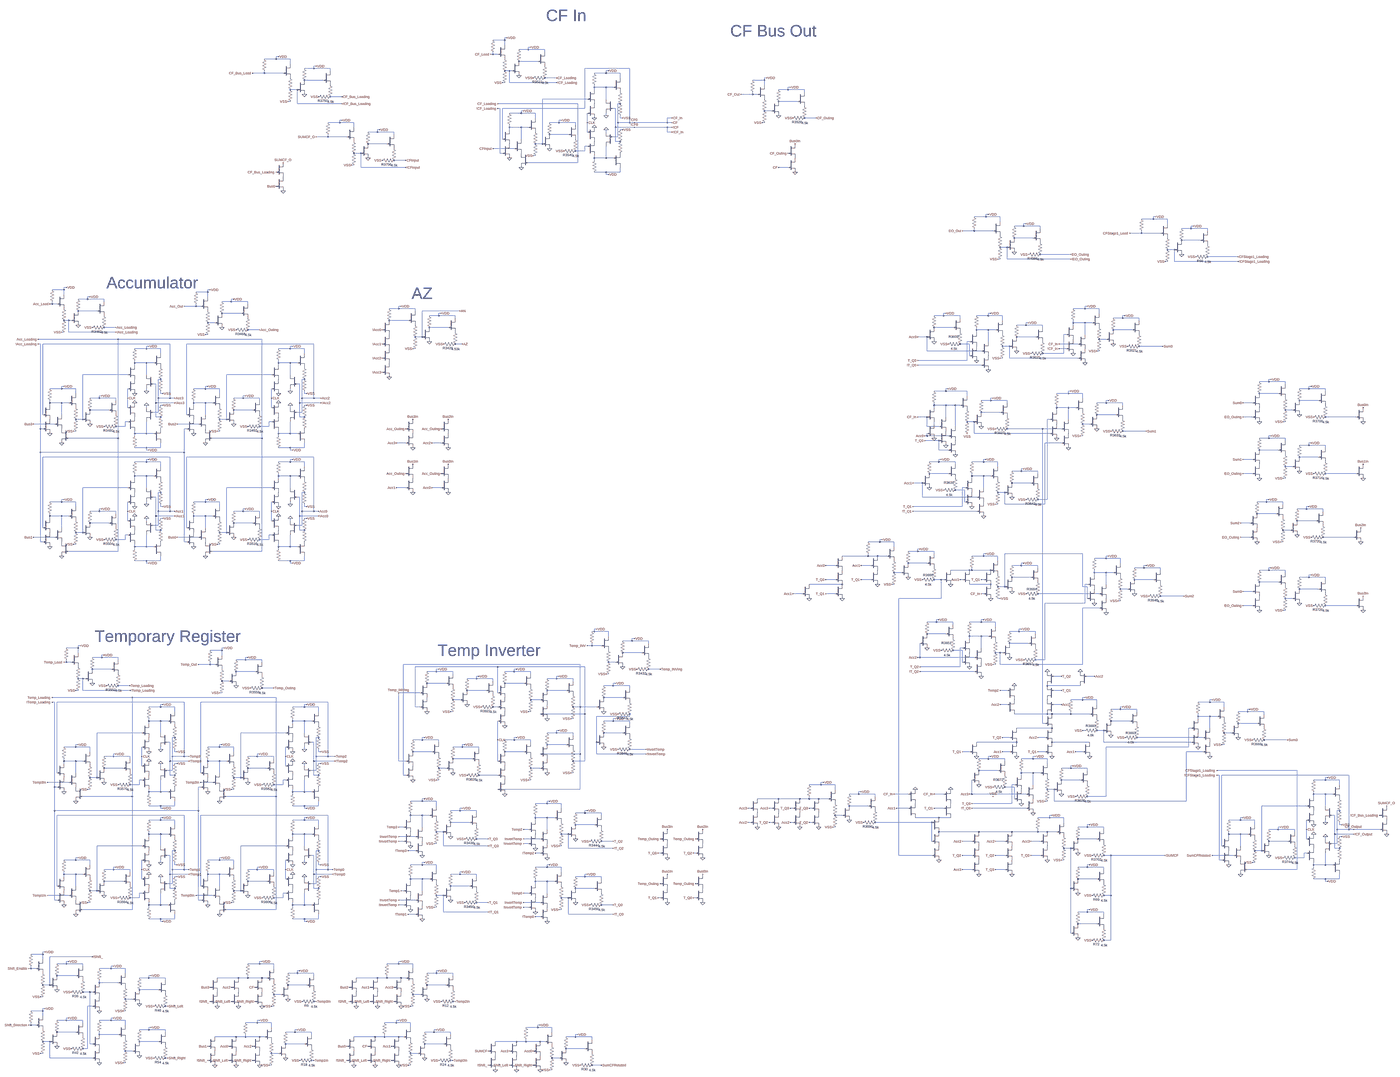
[diagram p0: schematic alu.asc, whole sheet]
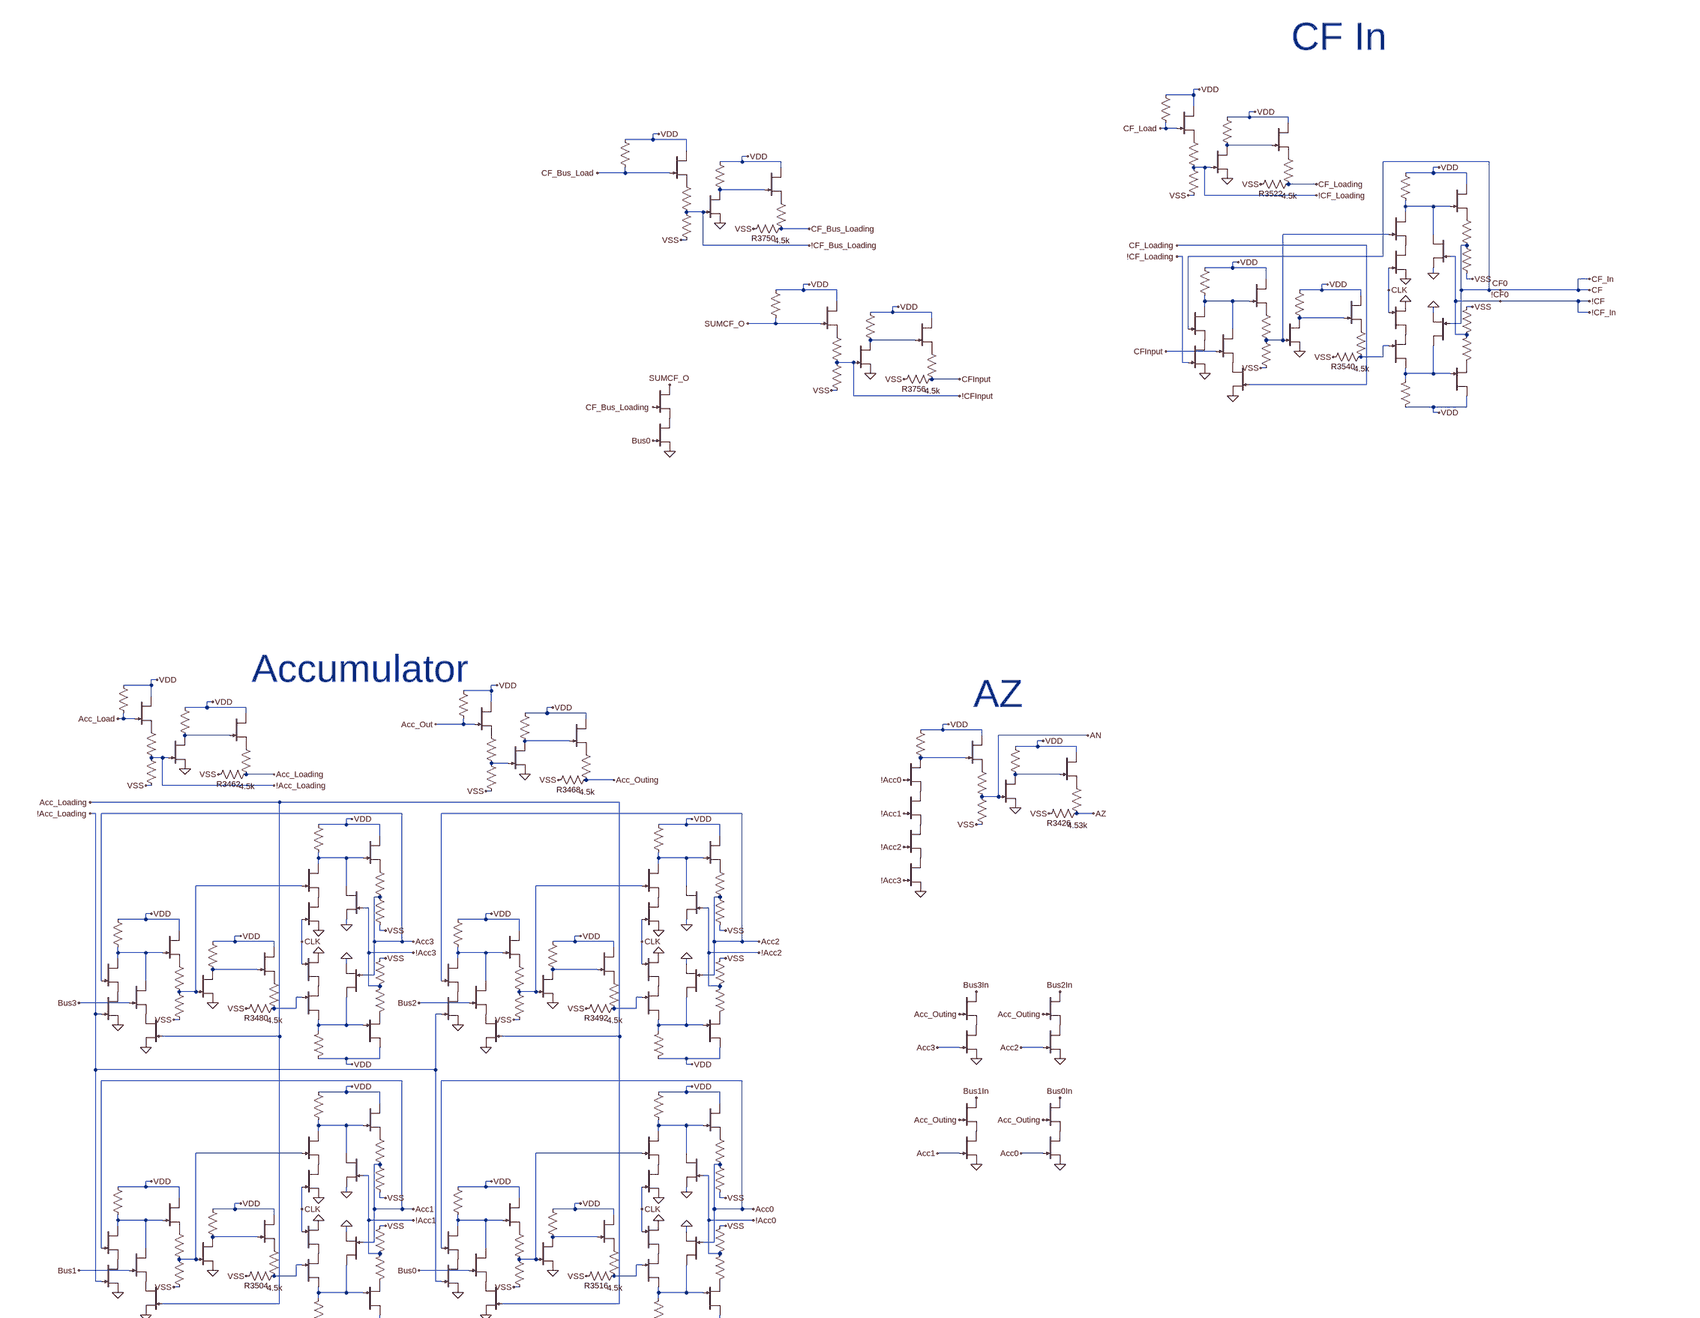
[diagram p1: schematic alu.asc, part, row 1 of 2, column 1 of 2]
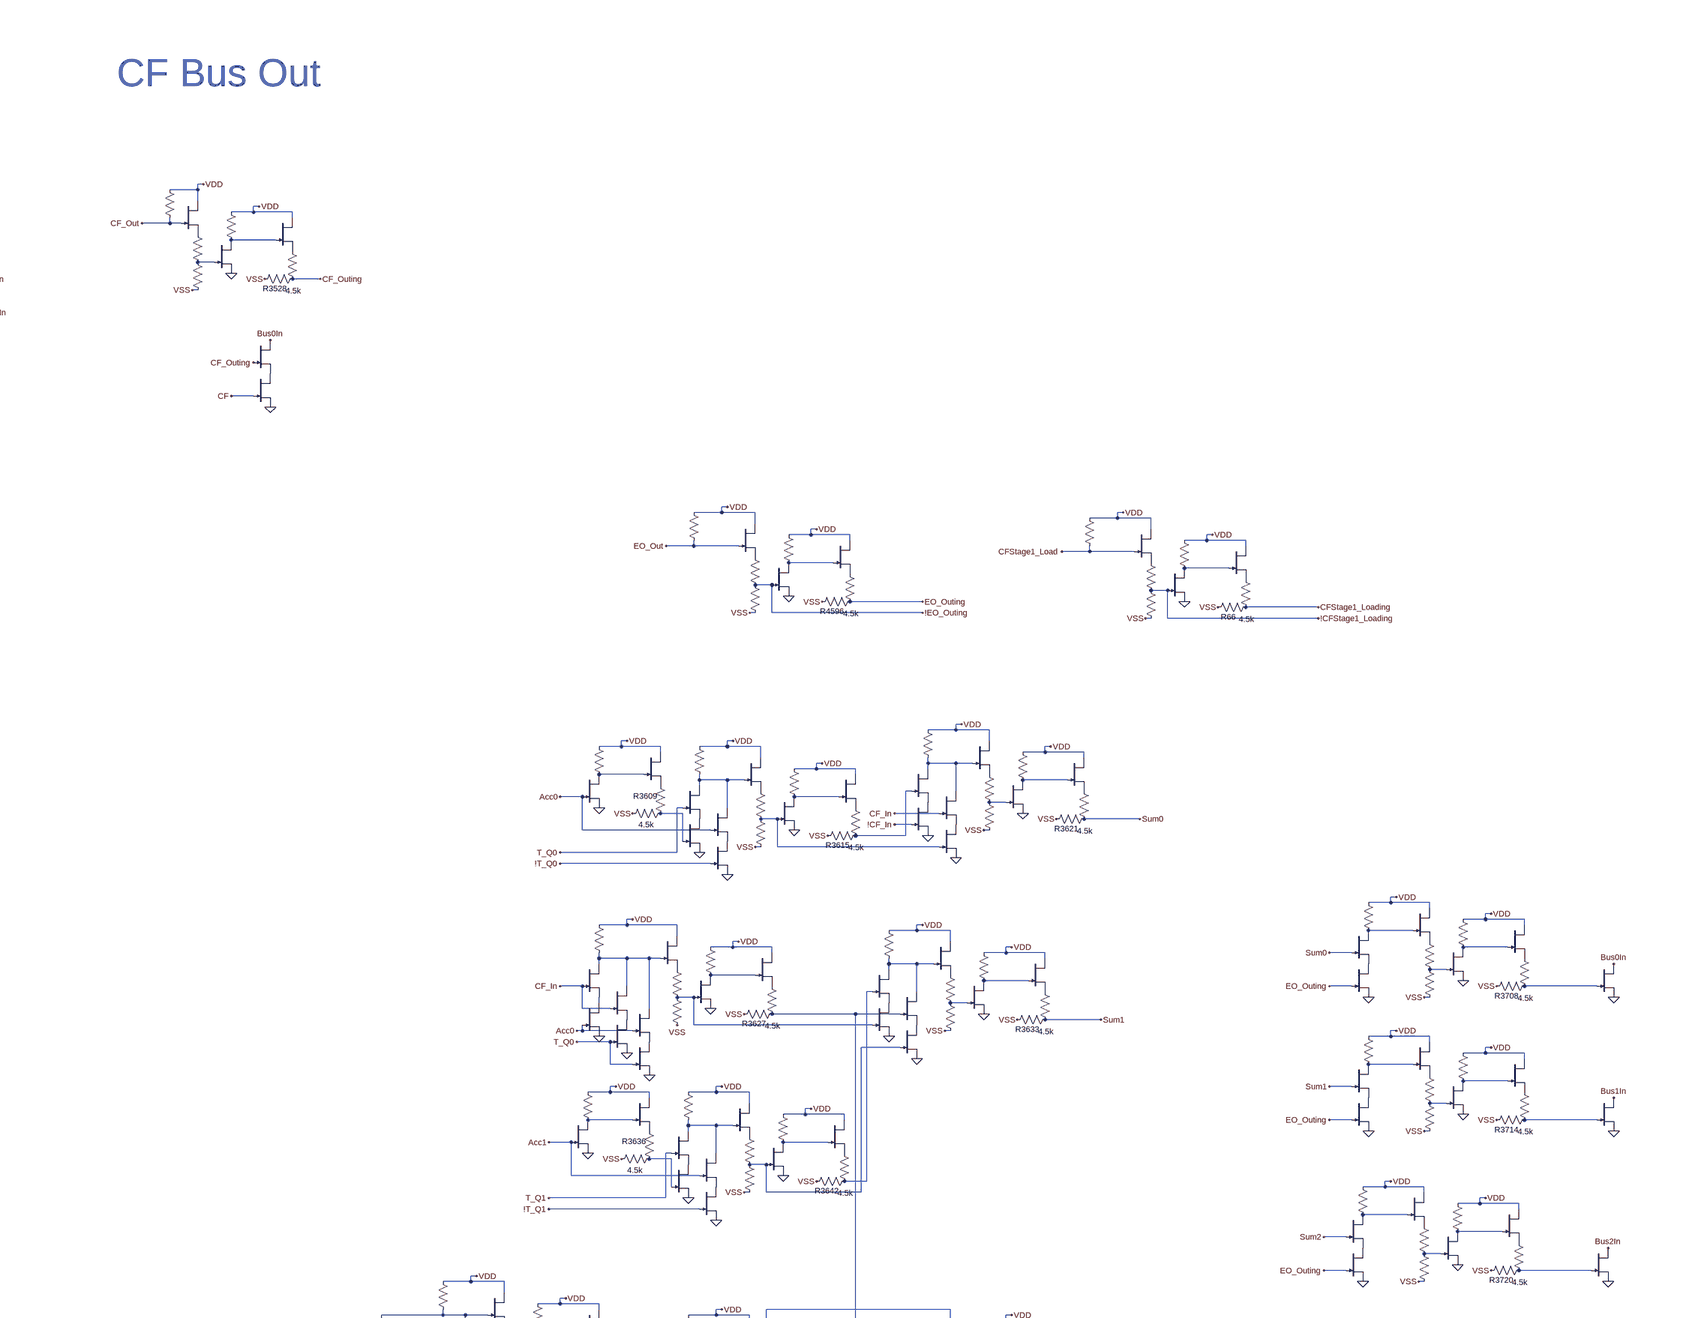
[diagram p2: schematic alu.asc, part, row 1 of 2, column 2 of 2]
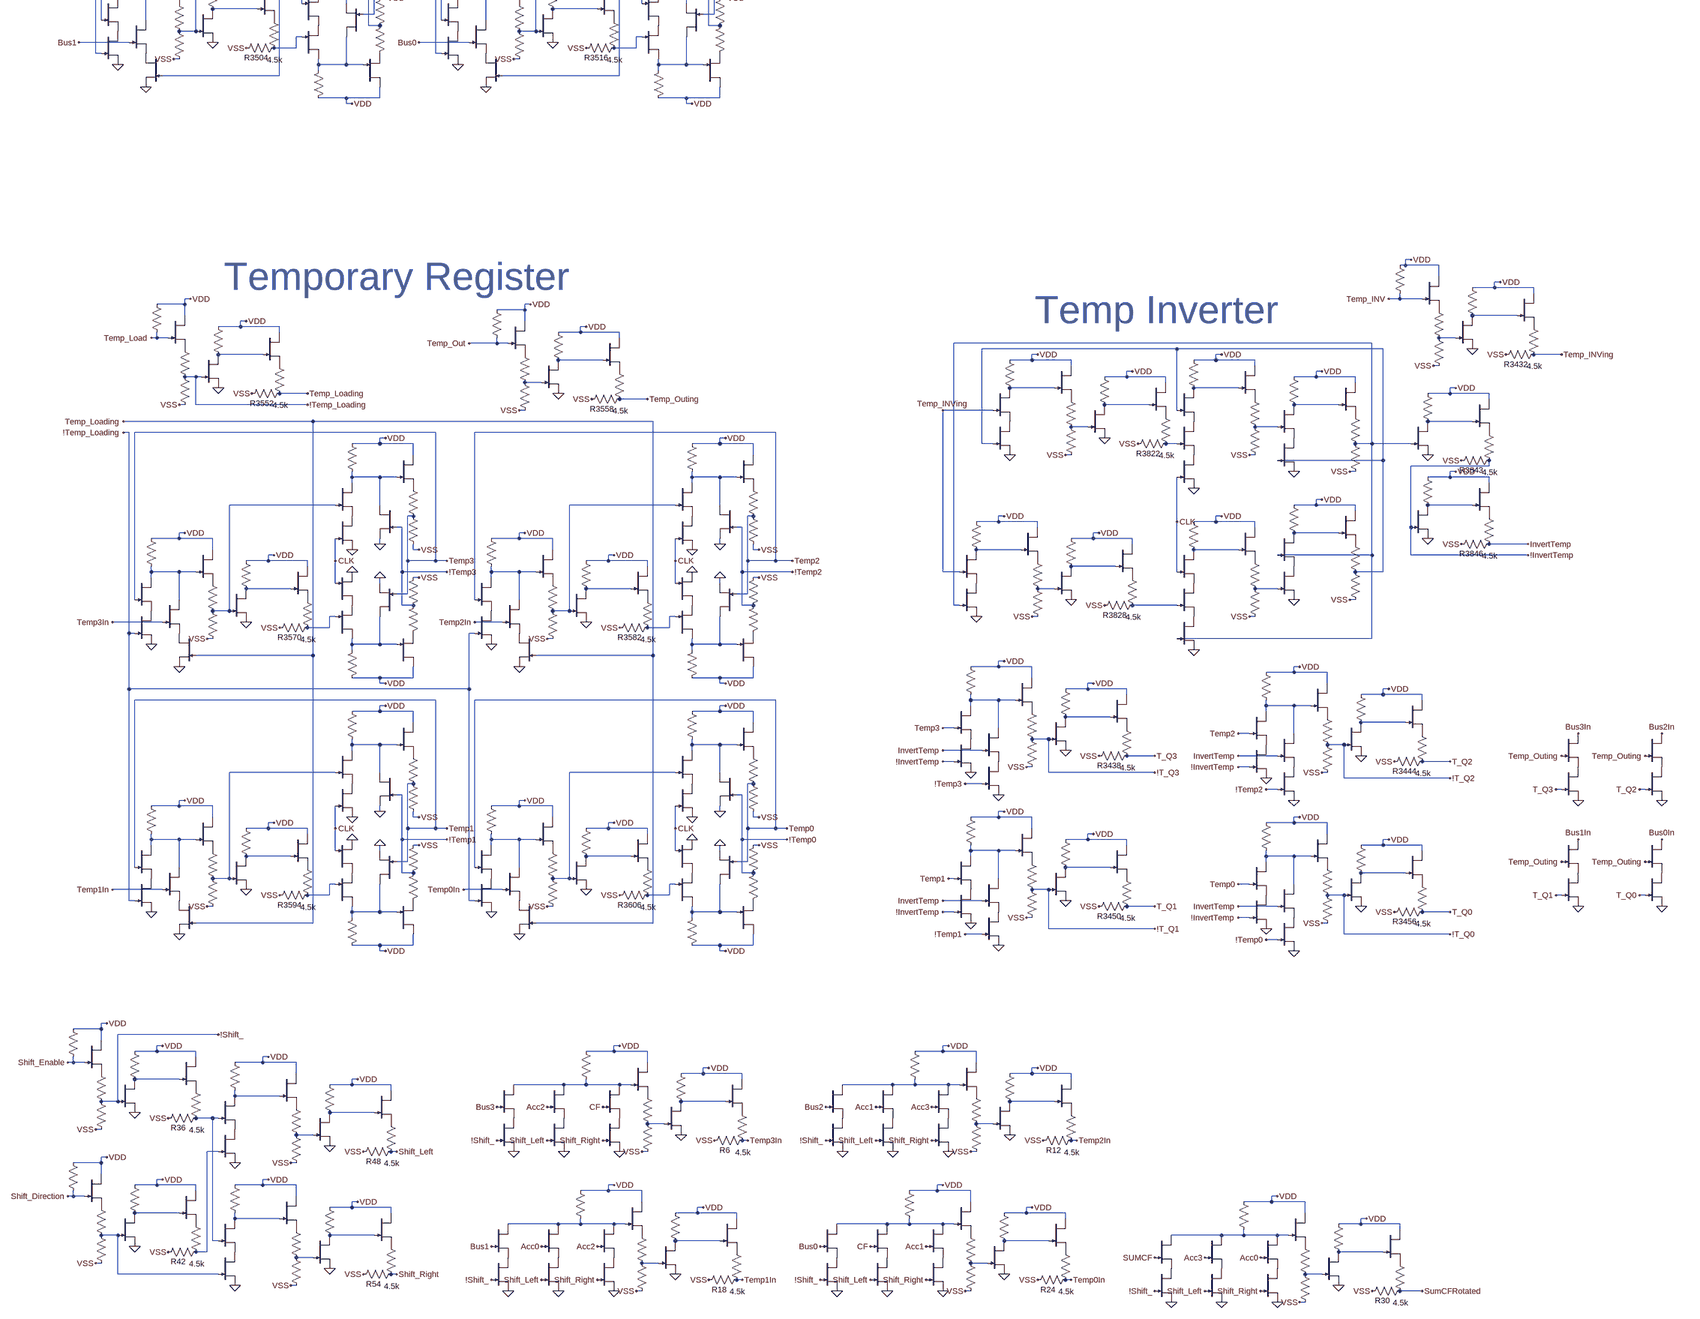
[diagram p3: schematic alu.asc, part, row 2 of 2, column 1 of 2]
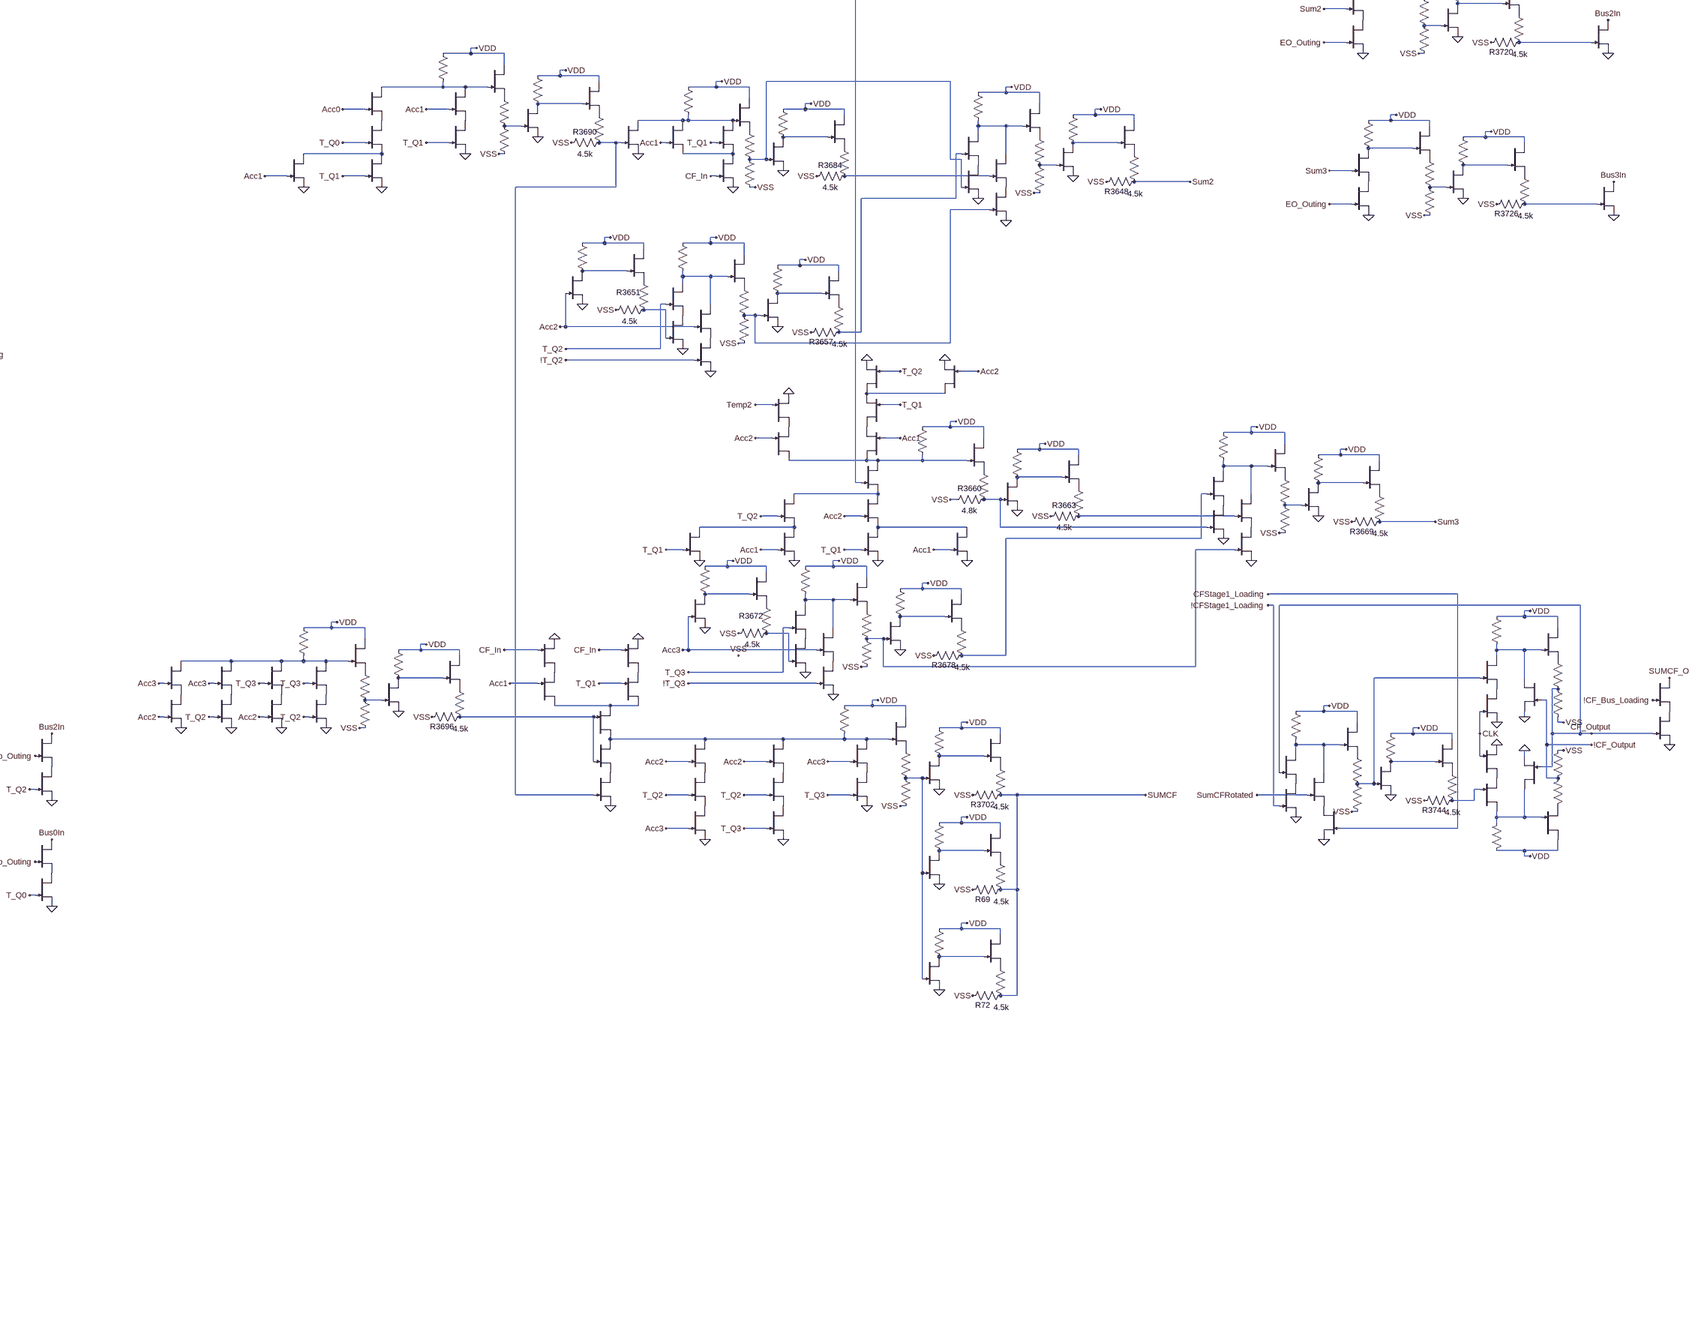
[diagram p4: schematic alu.asc, part, row 2 of 2, column 2 of 2]
* alu.asc
J_A2103 N016 !Acc0 P001 DR
R3421 VDD N016 100k
J_F874 VDD N016 P002 DR
R3422 P002 AN 1k
R3423 AN VSS 4.8k
J_B993 P001 !Acc1 P003 DR
J_A2104 N019 AN 0 DR
R3424 VDD N019 50k
J_F875 VDD N019 P004 DR
R3425 P004 AZ 1k
R3426 AZ VSS 4.53k
J_C1 P003 !Acc2 P005 DR
J_D1 P005 !Acc3 0 DR
J_A2105 P006 T_Q3 0 DR
J_A2106 Bus3In Temp_Outing P006 DR
J_A2107 P007 T_Q2 0 DR
J_A2108 Bus2In Temp_Outing P007 DR
J_A2109 P008 T_Q1 0 DR
J_A2110 Bus1In Temp_Outing P008 DR
J_A2111 P009 T_Q0 0 DR
J_A2112 Bus0In Temp_Outing P009 DR
R3427 VDD Temp_INV 100k
J_F876 VDD Temp_INV P010 DR
R3428 P010 N102 1k
R3429 N102 VSS 4.8k
J_A2113 N101 N102 0 DR
R3430 VDD N101 50k
J_A2114 VDD N101 P011 DR
R3431 P011 Temp_INVing 1k
R3432 Temp_INVing VSS 4.5k
J_A2115 N157 Temp3 P012 DR
R3433 VDD N157 100k
J_F877 VDD N157 P013 DR
R3434 P013 !T_Q3 1k
R3435 !T_Q3 VSS 4.8k
J_B994 N157 InvertTemp P014 DR
J_A2116 N161 !T_Q3 0 DR
R3436 VDD N161 50k
J_A2117 VDD N161 P015 DR
R3437 P015 T_Q3 1k
R3438 T_Q3 VSS 4.5k
J_A2118 P012 !InvertTemp 0 DR
J_B995 P014 !Temp3 0 DR
J_A2119 N159 Temp2 P016 DR
R3439 VDD N159 100k
J_F878 VDD N159 P017 DR
R3440 P017 !T_Q2 1k
R3441 !T_Q2 VSS 4.8k
J_B996 N159 InvertTemp P018 DR
J_A2120 N163 !T_Q2 0 DR
R3442 VDD N163 50k
J_A2121 VDD N163 P019 DR
R3443 P019 T_Q2 1k
R3444 T_Q2 VSS 4.5k
J_A2122 P016 !InvertTemp 0 DR
J_B997 P018 !Temp2 0 DR
J_A2123 N177 Temp1 P020 DR
R3445 VDD N177 100k
J_F879 VDD N177 P021 DR
R3446 P021 !T_Q1 1k
R3447 !T_Q1 VSS 4.8k
J_B998 N177 InvertTemp P022 DR
J_A2124 N182 !T_Q1 0 DR
R3448 VDD N182 50k
J_A2125 VDD N182 P023 DR
R3449 P023 T_Q1 1k
R3450 T_Q1 VSS 4.5k
J_A2126 P020 !InvertTemp 0 DR
J_B999 P022 !Temp1 0 DR
J_A2127 N181 Temp0 P024 DR
R3451 VDD N181 100k
J_F880 VDD N181 P025 DR
R3452 P025 !T_Q0 1k
R3453 !T_Q0 VSS 4.8k
J_B1000 N181 InvertTemp P026 DR
J_A2128 N183 !T_Q0 0 DR
R3454 VDD N183 50k
J_A2129 VDD N183 P027 DR
R3455 P027 T_Q0 1k
R3456 T_Q0 VSS 4.5k
J_A2130 P024 !InvertTemp 0 DR
J_B1001 P026 !Temp0 0 DR
R3457 VDD Acc_Load 100k
J_F881 VDD Acc_Load P028 DR
R3458 P028 !Acc_Loading 1k
R3459 !Acc_Loading VSS 4.8k
J_A2131 N014 !Acc_Loading 0 DR
R3460 VDD N014 50k
J_A2132 VDD N014 P029 DR
R3461 P029 Acc_Loading 1k
R3462 Acc_Loading VSS 4.5k
R3463 VDD Acc_Out 100k
J_F882 VDD Acc_Out P030 DR
R3464 P030 N017 1k
R3465 N017 VSS 4.8k
J_A2133 N015 N017 0 DR
R3466 VDD N015 50k
J_A2134 VDD N015 P031 DR
R3467 P031 Acc_Outing 1k
R3468 Acc_Outing VSS 4.5k
J_A2135 N028 N030 P032 DR
R3469 VDD N028 100k
J_F883 VDD N028 P033 DR
R3470 P033 Acc3 1k
R3471 Acc3 VSS 4.8k
J_B1002 N028 !Acc3 0 DR
J_A2136 N051 N045 P034 DR
R3472 VDD N051 100k
J_F884 VDD N051 P035 DR
R3473 P035 !Acc3 1k
R3474 !Acc3 VSS 4.8k
J_B1003 N051 Acc3 0 DR
J_A2137 P032 CLK 0 DR
J_A2138 P034 CLK 0 DR
J_A2139 N034 Acc3 P036 DR
R3475 VDD N034 100k
J_F885 VDD N034 P037 DR
R3476 P037 N030 1k
R3477 N030 VSS 4.8k
J_B1004 N034 Bus3 P038 DR
J_A2140 N038 N030 0 DR
R3478 VDD N038 50k
J_A2141 VDD N038 P039 DR
R3479 P039 N045 1k
R3480 N045 VSS 4.5k
J_A2142 P036 !Acc_Loading 0 DR
J_B1005 P038 Acc_Loading 0 DR
J_A2143 N029 N031 P040 DR
R3481 VDD N029 100k
J_F886 VDD N029 P041 DR
R3482 P041 Acc2 1k
R3483 Acc2 VSS 4.8k
J_B1006 N029 !Acc2 0 DR
J_A2144 N052 N046 P042 DR
R3484 VDD N052 100k
J_F887 VDD N052 P043 DR
R3485 P043 !Acc2 1k
R3486 !Acc2 VSS 4.8k
J_B1007 N052 Acc2 0 DR
J_A2145 P040 CLK 0 DR
J_A2146 P042 CLK 0 DR
J_A2147 N035 Acc2 P044 DR
R3487 VDD N035 100k
J_F888 VDD N035 P045 DR
R3488 P045 N031 1k
R3489 N031 VSS 4.8k
J_B1008 N035 Bus2 P046 DR
J_A2148 N039 N031 0 DR
R3490 VDD N039 50k
J_A2149 VDD N039 P047 DR
R3491 P047 N046 1k
R3492 N046 VSS 4.5k
J_A2150 P044 !Acc_Loading 0 DR
J_B1009 P046 Acc_Loading 0 DR
J_A2151 N059 N063 P048 DR
R3493 VDD N059 100k
J_F889 VDD N059 P049 DR
R3494 P049 Acc1 1k
R3495 Acc1 VSS 4.8k
J_B1010 N059 !Acc1 0 DR
J_A2152 N076 N073 P050 DR
R3496 VDD N076 100k
J_F890 VDD N076 P051 DR
R3497 P051 !Acc1 1k
R3498 !Acc1 VSS 4.8k
J_B1011 N076 Acc1 0 DR
J_A2153 P048 CLK 0 DR
J_A2154 P050 CLK 0 DR
J_A2155 N067 Acc1 P052 DR
R3499 VDD N067 100k
J_F891 VDD N067 P053 DR
R3500 P053 N063 1k
R3501 N063 VSS 4.8k
J_B1012 N067 Bus1 P054 DR
J_A2156 N070 N063 0 DR
R3502 VDD N070 50k
J_A2157 VDD N070 P055 DR
R3503 P055 N073 1k
R3504 N073 VSS 4.5k
J_A2158 P052 !Acc_Loading 0 DR
J_B1013 P054 Acc_Loading 0 DR
J_A2159 N060 N064 P056 DR
R3505 VDD N060 100k
J_F892 VDD N060 P057 DR
R3506 P057 Acc0 1k
R3507 Acc0 VSS 4.8k
J_B1014 N060 !Acc0 0 DR
J_A2160 N077 N074 P058 DR
R3508 VDD N077 100k
J_F893 VDD N077 P059 DR
R3509 P059 !Acc0 1k
R3510 !Acc0 VSS 4.8k
J_B1015 N077 Acc0 0 DR
J_A2161 P056 CLK 0 DR
J_A2162 P058 CLK 0 DR
J_A2163 N068 Acc0 P060 DR
R3511 VDD N068 100k
J_F894 VDD N068 P061 DR
R3512 P061 N064 1k
R3513 N064 VSS 4.8k
J_B1016 N068 Bus0 P062 DR
J_A2164 N071 N064 0 DR
R3514 VDD N071 50k
J_A2165 VDD N071 P063 DR
R3515 P063 N074 1k
R3516 N074 VSS 4.5k
J_A2166 P060 !Acc_Loading 0 DR
J_B1017 P062 Acc_Loading 0 DR
R3517 VDD CF_Load 100k
J_F895 VDD CF_Load P064 DR
R3518 P064 !CF_Loading 1k
R3519 !CF_Loading VSS 4.8k
J_A2167 N001 !CF_Loading 0 DR
R3520 VDD N001 50k
J_A2168 VDD N001 P065 DR
R3521 P065 CF_Loading 1k
R3522 CF_Loading VSS 4.5k
R3523 VDD CF_Out 100k
J_F896 VDD CF_Out P066 DR
R3524 P066 N006 1k
R3525 N006 VSS 4.8k
J_A2169 N005 N006 0 DR
R3526 VDD N005 50k
J_A2170 VDD N005 P067 DR
R3527 P067 CF_Outing 1k
R3528 CF_Outing VSS 4.5k
J_A2171 N003 N004 P068 DR
R3529 VDD N003 100k
J_F897 VDD N003 P069 DR
R3530 P069 CF0 1k
R3531 CF0 VSS 4.8k
J_B1018 N003 !CF 0 DR
J_A2172 N011 N010 P070 DR
R3532 VDD N011 100k
J_F898 VDD N011 P071 DR
R3533 P071 !CF 1k
R3534 !CF VSS 4.8k
J_B1019 N011 CF0 0 DR
J_A2173 P068 CLK 0 DR
J_A2174 P070 CLK 0 DR
J_A2175 N007 CF0 P072 DR
R3535 VDD N007 100k
J_F899 VDD N007 P073 DR
R3536 P073 N004 1k
R3537 N004 VSS 4.8k
J_B1020 N007 CFInput P074 DR
J_A2176 N008 N004 0 DR
R3538 VDD N008 50k
J_A2177 VDD N008 P075 DR
R3539 P075 N010 1k
R3540 N010 VSS 4.5k
J_A2178 P072 !CF_Loading 0 DR
J_B1021 P074 CF_Loading 0 DR
J_A2181 P076 CF0 0 DR
J_A2182 Bus0In CF_Outing P076 DR
R3547 VDD Temp_Load 100k
J_F901 VDD Temp_Load P077 DR
R3548 P077 !Temp_Loading 1k
R3549 !Temp_Loading VSS 4.8k
J_A2183 N105 !Temp_Loading 0 DR
R3550 VDD N105 50k
J_A2184 VDD N105 P078 DR
R3551 P078 Temp_Loading 1k
R3552 Temp_Loading VSS 4.5k
R3553 VDD Temp_Out 100k
J_F902 VDD Temp_Out P079 DR
R3554 P079 N107 1k
R3555 N107 VSS 4.8k
J_A2185 N106 N107 0 DR
R3556 VDD N106 50k
J_A2186 VDD N106 P080 DR
R3557 P080 Temp_Outing 1k
R3558 Temp_Outing VSS 4.5k
J_A2187 N119 N126 P081 DR
R3559 VDD N119 100k
J_F903 VDD N119 P082 DR
R3560 P082 Temp3 1k
R3561 Temp3 VSS 4.8k
J_B1024 N119 !Temp3 0 DR
J_A2188 N151 N147 P083 DR
R3562 VDD N151 100k
J_F904 VDD N151 P084 DR
R3563 P084 !Temp3 1k
R3564 !Temp3 VSS 4.8k
J_B1025 N151 Temp3 0 DR
J_A2189 P081 CLK 0 DR
J_A2190 P083 CLK 0 DR
J_A2191 N138 Temp3 P085 DR
R3565 VDD N138 100k
J_F905 VDD N138 P086 DR
R3566 P086 N126 1k
R3567 N126 VSS 4.8k
J_B1026 N138 Temp3In P087 DR
J_A2192 N140 N126 0 DR
R3568 VDD N140 50k
J_A2193 VDD N140 P088 DR
R3569 P088 N147 1k
R3570 N147 VSS 4.5k
J_A2194 P085 !Temp_Loading 0 DR
J_B1027 P087 Temp_Loading 0 DR
J_A2195 N120 N127 P089 DR
R3571 VDD N120 100k
J_F906 VDD N120 P090 DR
R3572 P090 Temp2 1k
R3573 Temp2 VSS 4.8k
J_B1028 N120 !Temp2 0 DR
J_A2196 N152 N148 P091 DR
R3574 VDD N152 100k
J_F907 VDD N152 P092 DR
R3575 P092 !Temp2 1k
R3576 !Temp2 VSS 4.8k
J_B1029 N152 Temp2 0 DR
J_A2197 P089 CLK 0 DR
J_A2198 P091 CLK 0 DR
J_A2199 N139 Temp2 P093 DR
R3577 VDD N139 100k
J_F908 VDD N139 P094 DR
R3578 P094 N127 1k
R3579 N127 VSS 4.8k
J_B1030 N139 Temp2In P095 DR
J_A2200 N141 N127 0 DR
R3580 VDD N141 50k
J_A2201 VDD N141 P096 DR
R3581 P096 N148 1k
R3582 N148 VSS 4.5k
J_A2202 P093 !Temp_Loading 0 DR
J_B1031 P095 Temp_Loading 0 DR
J_A2203 N165 N170 P097 DR
R3583 VDD N165 100k
J_F909 VDD N165 P098 DR
R3584 P098 Temp1 1k
R3585 Temp1 VSS 4.8k
J_B1032 N165 !Temp1 0 DR
J_A2204 N186 N184 P099 DR
R3586 VDD N186 100k
J_F910 VDD N186 P100 DR
R3587 P100 !Temp1 1k
R3588 !Temp1 VSS 4.8k
J_B1033 N186 Temp1 0 DR
J_A2205 P097 CLK 0 DR
J_A2206 P099 CLK 0 DR
J_A2207 N175 Temp1 P101 DR
R3589 VDD N175 100k
J_F911 VDD N175 P102 DR
R3590 P102 N170 1k
R3591 N170 VSS 4.8k
J_B1034 N175 Temp1In P103 DR
J_A2208 N179 N170 0 DR
R3592 VDD N179 50k
J_A2209 VDD N179 P104 DR
R3593 P104 N184 1k
R3594 N184 VSS 4.5k
J_A2210 P101 !Temp_Loading 0 DR
J_B1035 P103 Temp_Loading 0 DR
J_A2211 N166 N171 P105 DR
R3595 VDD N166 100k
J_F912 VDD N166 P106 DR
R3596 P106 Temp0 1k
R3597 Temp0 VSS 4.8k
J_B1036 N166 !Temp0 0 DR
J_A2212 N187 N185 P107 DR
R3598 VDD N187 100k
J_F913 VDD N187 P108 DR
R3599 P108 !Temp0 1k
R3600 !Temp0 VSS 4.8k
J_B1037 N187 Temp0 0 DR
J_A2213 P105 CLK 0 DR
J_A2214 P107 CLK 0 DR
J_A2215 N176 Temp0 P109 DR
R3601 VDD N176 100k
J_F914 VDD N176 P110 DR
R3602 P110 N171 1k
R3603 N171 VSS 4.8k
J_B1038 N176 Temp0In P111 DR
J_A2216 N180 N171 0 DR
R3604 VDD N180 50k
J_A2217 VDD N180 P112 DR
R3605 P112 N185 1k
R3606 N185 VSS 4.5k
J_A2218 P109 !Temp_Loading 0 DR
J_B1039 P111 Temp_Loading 0 DR
J_A2219 N081 Acc1 N089 DR
J_A2220 N020 Acc0 0 DR
R3607 VDD N020 50k
J_A2221 VDD N020 P113 DR
R3608 P113 N026 1k
R3609 N026 VSS 4.5k
J_A2222 N021 T_Q0 P114 DR
R3610 VDD N021 100k
J_F915 VDD N021 P115 DR
R3611 P115 N027 1k
R3612 N027 VSS 4.8k
J_B1040 N021 Acc0 P116 DR
J_A2223 N024 N027 0 DR
R3613 VDD N024 50k
J_A2224 VDD N024 P117 DR
R3614 P117 N023 1k
R3615 N023 VSS 4.5k
J_A2225 P114 N026 0 DR
J_B1041 P116 !T_Q0 0 DR
J_A2226 N018 N023 P118 DR
R3616 VDD N018 100k
J_F916 VDD N018 P119 DR
R3617 P119 N025 1k
R3618 N025 VSS 4.8k
J_B1042 N018 CF0 P120 DR
J_A2227 N022 N025 0 DR
R3619 VDD N022 50k
J_A2228 VDD N022 P121 DR
R3620 P121 Sum0 1k
R3621 Sum0 VSS 4.5k
J_A2229 P118 !CF 0 DR
J_B1043 P120 N027 0 DR
J_A2230 N036 CF0 N048 DR
R3622 VDD N036 100k
J_F917 VDD N036 P122 DR
R3623 P122 N047 1k
R3624 N047 VSS 4.8k
J_B1044 N036 CF0 P123 DR
J_A2231 N041 N047 0 DR
R3625 VDD N041 50k
J_A2232 VDD N041 P124 DR
R3626 P124 N050 1k
R3627 N050 VSS 4.5k
J_A2233 N048 Acc0 0 DR
J_B1045 P123 T_Q0 0 DR
J_B1046 N036 Acc0 P125 DR
J_B1047 P125 T_Q0 0 DR
J_A2234 N037 N044 P126 DR
R3628 VDD N037 100k
J_F918 VDD N037 P127 DR
R3629 P127 N049 1k
R3630 N049 VSS 4.8k
J_B1048 N037 N050 P128 DR
J_A2235 N042 N049 0 DR
R3631 VDD N042 50k
J_A2236 VDD N042 P129 DR
R3632 P129 Sum1 1k
R3633 Sum1 VSS 4.5k
J_A2237 P126 N047 0 DR
J_B1049 P128 N053 0 DR
J_A2238 N057 Acc1 0 DR
R3634 VDD N057 50k
J_A2239 VDD N057 P130 DR
R3635 P130 N065 1k
R3636 N065 VSS 4.5k
J_A2240 N061 T_Q1 P131 DR
R3637 VDD N061 100k
J_F919 VDD N061 P132 DR
R3638 P132 N053 1k
R3639 N053 VSS 4.8k
J_B1050 N061 Acc1 P133 DR
J_A2241 N062 N053 0 DR
R3640 VDD N062 50k
J_A2242 VDD N062 P134 DR
R3641 P134 N044 1k
R3642 N044 VSS 4.5k
J_A2243 P131 N065 0 DR
J_B1051 P133 !T_Q1 0 DR
J_A2244 N081 T_Q1 N089 DR
J_A2245 N083 N090 P135 DR
R3643 VDD N083 100k
J_F920 VDD N083 P136 DR
R3644 P136 N091 1k
R3645 N091 VSS 4.8k
J_B1052 N083 N093 P137 DR
J_A2246 N086 N091 0 DR
R3646 VDD N086 50k
J_A2247 VDD N086 P138 DR
R3647 P138 Sum2 1k
R3648 Sum2 VSS 4.5k
J_A2248 P135 N078 0 DR
J_B1053 P137 N096 0 DR
J_A2249 N097 Acc2 0 DR
R3649 VDD N097 50k
J_A2250 VDD N097 P139 DR
R3650 P139 N100 1k
R3651 N100 VSS 4.5k
J_A2251 N098 T_Q2 P140 DR
R3652 VDD N098 100k
J_F921 VDD N098 P141 DR
R3653 P141 N096 1k
R3654 N096 VSS 4.8k
J_B1054 N098 Acc2 P142 DR
J_A2252 N099 N096 0 DR
R3655 VDD N099 50k
J_A2253 VDD N099 P143 DR
R3656 P143 N090 1k
R3657 N090 VSS 4.5k
J_A2254 P140 N100 0 DR
J_B1055 P142 !T_Q2 0 DR
R3658 VDD N117 100k
J_F922 VDD N117 P144 DR
R3659 P144 N125 1k
R3660 N125 VSS 4.8k
J_A2255 N121 N125 0 DR
R3661 VDD N121 50k
J_A2256 VDD N121 P145 DR
R3662 P145 N130 1k
R3663 N130 VSS 4.5k
J_A2257 N117 Acc2 P146 DR
J_B1056 P146 Temp2 0 DR
J_A2258 N117 Acc1 P147 DR
J_B1057 P147 T_Q1 N110 DR
J_B1058 N110 T_Q2 0 DR
J_B1059 N110 Acc2 0 DR
J_A2259 N132 Acc1 0 DR
J_A2260 N123 T_Q2 N131 DR
J_B1060 N131 Acc1 0 DR
J_A2261 N132 T_Q1 0 DR
J_B1061 N123 Acc2 N132 DR
J_B1062 N131 T_Q1 0 DR
J_B1063 N117 N050 N123 DR
J_A2262 N118 N124 P148 DR
R3664 VDD N118 100k
J_F923 VDD N118 P149 DR
R3665 P149 N129 1k
R3666 N129 VSS 4.8k
J_B1064 N118 N130 P150 DR
J_A2263 N122 N129 0 DR
R3667 VDD N122 50k
J_A2264 VDD N122 P151 DR
R3668 P151 Sum3 1k
R3669 Sum3 VSS 4.5k
J_A2265 P148 N125 0 DR
J_B1065 P150 N136 0 DR
J_A2266 N144 Acc3 0 DR
R3670 VDD N144 50k
J_A2267 VDD N144 P152 DR
R3671 P152 N150 1k
R3672 N150 VSS 4.5k
J_A2268 N145 T_Q3 P153 DR
R3673 VDD N145 100k
J_F924 VDD N145 P154 DR
R3674 P154 N136 1k
R3675 N136 VSS 4.8k
J_B1066 N145 Acc3 P155 DR
J_A2269 N149 N136 0 DR
R3676 VDD N149 50k
J_A2270 VDD N149 P156 DR
R3677 P156 N124 1k
R3678 N124 VSS 4.5k
J_A2271 P153 N150 0 DR
J_B1067 P155 !T_Q3 0 DR
R3679 VDD N081 100k
J_F925 VDD N081 P157 DR
R3680 P157 N078 1k
R3681 N078 VSS 4.8k
J_A2272 N084 N078 0 DR
R3682 VDD N084 50k
J_A2273 VDD N084 P158 DR
R3683 P158 N093 1k
R3684 N093 VSS 4.5k
J_A2274 N079 Acc1 P159 DR
J_B1068 P159 T_Q1 0 DR
J_A2275 N079 Acc0 P160 DR
J_B1069 P160 T_Q0 N088 DR
R3685 VDD N079 100k
J_F926 VDD N079 P161 DR
R3686 P161 N082 1k
R3687 N082 VSS 4.8k
J_A2276 N080 N082 0 DR
R3688 VDD N080 50k
J_A2277 VDD N080 P162 DR
R3689 P162 N085 1k
R3690 N085 VSS 4.5k
J_B1070 N088 Acc1 0 DR
J_B1071 N088 T_Q1 0 DR
J_B1072 N089 CF0 0 DR
J_A2278 N081 N085 0 DR
J_A2279 N164 N162 P163 DR
J_B1073 P163 N085 0 DR
J_A2280 N160 T_Q1 P164 DR
J_B1074 P164 CF0 0 DR
J_A2281 N160 Acc1 P165 DR
J_B1075 P165 CF0 0 DR
R3691 VDD N154 100k
J_F927 VDD N154 P166 DR
R3692 P166 N158 1k
R3693 N158 VSS 4.8k
J_A2282 N155 N158 0 DR
R3694 VDD N155 50k
J_A2283 VDD N155 P167 DR
R3695 P167 N162 1k
R3696 N162 VSS 4.5k
J_A2284 N154 Acc3 P168 DR
J_A2285 N154 T_Q3 P169 DR
J_B1076 P168 T_Q2 0 DR
J_B1077 P169 T_Q2 0 DR
J_A2286 N164 Acc3 P170 DR
J_B1078 P170 T_Q3 0 DR
J_A2287 N164 Acc2 P171 DR
J_B1079 P171 T_Q2 P172 DR
J_B1080 P172 T_Q3 0 DR
J_A2288 N164 Acc2 P173 DR
J_B1081 P173 T_Q2 P174 DR
J_B1082 P174 Acc3 0 DR
J_A2289 N164 N162 N160 DR
R3697 VDD N164 100k
J_F928 VDD N164 P175 DR
R3698 P175 N172 1k
R3699 N172 VSS 4.8k
J_A2290 N168 N172 0 DR
R3700 VDD N168 50k
J_A2291 VDD N168 P176 DR
R3701 P176 SUMCF 1k
R3702 SUMCF VSS 4.5k
J_A2292 N032 Sum0 P177 DR
R3703 VDD N032 100k
J_F929 VDD N032 P178 DR
R3704 P178 N040 1k
R3705 N040 VSS 4.8k
J_B1083 P177 EO_Outing 0 DR
J_A2293 N033 N040 0 DR
R3706 VDD N033 50k
J_F930 VDD N033 P179 DR
R3707 P179 N043 1k
R3708 N043 VSS 4.5k
J_A2294 Bus0In N043 0 DR
J_A2295 N054 Sum1 P180 DR
R3709 VDD N054 100k
J_F931 VDD N054 P181 DR
R3710 P181 N056 1k
R3711 N056 VSS 4.8k
J_B1084 P180 EO_Outing 0 DR
J_A2296 N055 N056 0 DR
R3712 VDD N055 50k
J_F932 VDD N055 P182 DR
R3713 P182 N058 1k
R3714 N058 VSS 4.5k
J_A2297 Bus1In N058 0 DR
J_A2298 N066 Sum2 P183 DR
R3715 VDD N066 100k
J_F933 VDD N066 P184 DR
R3716 P184 N072 1k
R3717 N072 VSS 4.8k
J_B1085 P183 EO_Outing 0 DR
J_A2299 N069 N072 0 DR
R3718 VDD N069 50k
J_F934 VDD N069 P185 DR
R3719 P185 N075 1k
R3720 N075 VSS 4.5k
J_A2300 Bus2In N075 0 DR
J_A2301 N087 Sum3 P186 DR
R3721 VDD N087 100k
J_F935 VDD N087 P187 DR
R3722 P187 N094 1k
R3723 N094 VSS 4.8k
J_B1086 P186 EO_Outing 0 DR
J_A2302 N092 N094 0 DR
R3724 VDD N092 50k
J_F936 VDD N092 P188 DR
R3725 P188 N095 1k
R3726 N095 VSS 4.5k
J_A2303 Bus3In N095 0 DR
J_A2307 N153 N156 P189 DR
R3733 VDD N153 100k
J_F939 VDD N153 P190 DR
R3734 P190 CF_Output 1k
R3735 CF_Output VSS 4.8k
J_B1089 N153 !CF_Output 0 DR
J_A2308 N174 N173 P191 DR
R3736 VDD N174 100k
J_F940 VDD N174 P192 DR
R3737 P192 !CF_Output 1k
R3738 !CF_Output VSS 4.8k
J_B1090 N174 CF_Output 0 DR
J_A2309 P189 CLK 0 DR
J_A2310 P191 CLK 0 DR
J_A2311 N167 CF_Output P193 DR
R3739 VDD N167 100k
J_F941 VDD N167 P194 DR
R3740 P194 N156 1k
R3741 N156 VSS 4.8k
J_B1091 N167 SumCFRotated P195 DR
J_A2312 N169 N156 0 DR
R3742 VDD N169 50k
J_A2313 VDD N169 P196 DR
R3743 P196 N173 1k
R3744 N173 VSS 4.5k
J_A2314 P193 !CFStage1_Loading 0 DR
J_B1092 P195 CFStage1_Loading 0 DR
R3745 VDD CF_Bus_Load 100k
J_F942 VDD CF_Bus_Load P197 DR
R3746 P197 !CF_Bus_Loading 1k
R3747 !CF_Bus_Loading VSS 4.8k
J_A2315 N002 !CF_Bus_Loading 0 DR
R3748 VDD N002 50k
J_A2316 VDD N002 P198 DR
R3749 P198 CF_Bus_Loading 1k
R3750 CF_Bus_Loading VSS 4.5k
J_A2317 P199 CF_Output 0 DR
J_A2318 SUMCF_O !CF_Bus_Loading P199 DR
J_A2319 SUMCF_O CF_Bus_Loading P200 DR
J_A2320 P200 Bus0 0 DR
R3751 VDD SUMCF_O 100k
J_F943 VDD SUMCF_O P201 DR
R3752 P201 !CFInput 1k
R3753 !CFInput VSS 4.8k
J_A2321 N009 !CFInput 0 DR
R3754 VDD N009 50k
J_A2322 VDD N009 P202 DR
R3755 P202 CFInput 1k
R3756 CFInput VSS 4.5k
J_A2323 P203 Acc3 0 DR
J_A2324 Bus3In Acc_Outing P203 DR
J_A2325 P204 Acc2 0 DR
J_A2326 Bus2In Acc_Outing P204 DR
J_A2327 P205 Acc1 0 DR
J_A2328 Bus1In Acc_Outing P205 DR
J_A2329 P206 Acc0 0 DR
J_A2330 Bus0In Acc_Outing P206 DR
J_A2359 N108 Temp_INVing P207 DR
R3817 VDD N108 100k
J_F959 VDD N108 P208 DR
R3818 P208 N114 1k
R3819 N114 VSS 4.8k
J_B1109 P207 N104 0 DR
J_A2360 N111 N114 0 DR
R3820 VDD N111 50k
J_F960 VDD N111 P209 DR
R3821 P209 N116 1k
R3822 N116 VSS 4.5k
J_A2361 N134 Temp_INVing P210 DR
R3823 VDD N134 100k
J_F961 VDD N134 P211 DR
R3824 P211 N142 1k
R3825 N142 VSS 4.8k
J_B1110 P210 N103 0 DR
J_A2362 N137 N142 0 DR
R3826 VDD N137 50k
J_F962 VDD N137 P212 DR
R3827 P212 N146 1k
R3828 N146 VSS 4.5k
J_A2363 N109 N104 P213 DR
R3829 VDD N109 100k
J_F963 VDD N109 P214 DR
R3830 P214 N115 1k
R3831 N115 VSS 4.8k
J_B1111 P213 N116 P215 DR
J_A2364 N135 CLK P216 DR
R3832 VDD N135 100k
J_F964 VDD N135 P217 DR
R3833 P217 N143 1k
R3834 N143 VSS 4.8k
J_B1112 P216 N146 P218 DR
J_A2365 N112 N115 P219 DR
R3835 VDD N112 100k
J_F965 VDD N112 P220 DR
R3836 P220 N103 1k
R3837 N103 VSS 4.8k
J_B1113 P219 N104 0 DR
J_A2366 N133 N103 P221 DR
R3838 VDD N133 100k
J_F966 VDD N133 P222 DR
R3839 P222 N104 1k
R3840 N104 VSS 4.8k
J_B1114 P221 N143 0 DR
J_B1115 P215 CLK 0 DR
J_B1116 P218 N103 0 DR
J_A2367 N113 N103 0 DR
R3841 VDD N113 50k
J_F967 VDD N113 P223 DR
R3842 P223 !InvertTemp 1k
R3843 !InvertTemp VSS 4.5k
J_A2368 N128 !InvertTemp 0 DR
R3844 VDD N128 50k
J_F968 VDD N128 P224 DR
R3845 P224 InvertTemp 1k
R3846 InvertTemp VSS 4.5k
R4591 VDD EO_Out 100k
J_F1212 VDD EO_Out P225 DR
R4592 P225 !EO_Outing 1k
R4593 !EO_Outing VSS 4.8k
J_A2658 N012 !EO_Outing 0 DR
R4594 VDD N012 50k
J_A2659 VDD N012 P226 DR
R4595 P226 EO_Outing 1k
R4596 EO_Outing VSS 4.5k
J_A1 N190 Acc2 P227 DR
R1 VDD N190 100k
J_F1 VDD N190 P228 DR
R2 P228 N197 1k
R3 N197 VSS 4.8k
J_B1 N190 CF0 P229 DR
J_A2 N193 N197 0 DR
R4 VDD N193 50k
J_A3 VDD N193 P230 DR
R5 P230 Temp3In 1k
R6 Temp3In VSS 4.5k
J_A4 P227 Shift_Left 0 DR
J_B2 P229 Shift_Right 0 DR
J_A5 N190 Bus3 P231 DR
J_A6 P231 !Shift_ 0 DR
J_A7 N191 Acc1 P232 DR
R7 VDD N191 100k
J_F2 VDD N191 P233 DR
R8 P233 N198 1k
R9 N198 VSS 4.8k
J_B3 N191 Acc3 P234 DR
J_A8 N194 N198 0 DR
R10 VDD N194 50k
J_A9 VDD N194 P235 DR
R11 P235 Temp2In 1k
R12 Temp2In VSS 4.5k
J_A10 P232 Shift_Left 0 DR
J_B4 P234 Shift_Right 0 DR
J_A11 N191 Bus2 P236 DR
J_A12 P236 !Shift_ 0 DR
J_A13 N203 Acc0 P237 DR
R13 VDD N203 100k
J_F3 VDD N203 P238 DR
R14 P238 N212 1k
R15 N212 VSS 4.8k
J_B5 N203 Acc2 P239 DR
J_A14 N208 N212 0 DR
R16 VDD N208 50k
J_A15 VDD N208 P240 DR
R17 P240 Temp1In 1k
R18 Temp1In VSS 4.5k
J_A16 P237 Shift_Left 0 DR
J_B6 P239 Shift_Right 0 DR
J_A17 N203 Bus1 P241 DR
J_A18 P241 !Shift_ 0 DR
J_A19 N204 CF0 P242 DR
R19 VDD N204 100k
J_F4 VDD N204 P243 DR
R20 P243 N213 1k
R21 N213 VSS 4.8k
J_B7 N204 Acc1 P244 DR
J_A20 N209 N213 0 DR
R22 VDD N209 50k
J_A21 VDD N209 P245 DR
R23 P245 Temp0In 1k
R24 Temp0In VSS 4.5k
J_A22 P242 Shift_Left 0 DR
J_B8 P244 Shift_Right 0 DR
J_A23 N204 Bus0 P246 DR
J_A24 P246 !Shift_ 0 DR
J_A25 N207 Acc3 P247 DR
R25 VDD N207 100k
J_F5 VDD N207 P248 DR
R26 P248 N214 1k
R27 N214 VSS 4.8k
J_B9 N207 Acc0 P249 DR
J_A26 N210 N214 0 DR
R28 VDD N210 50k
J_A27 VDD N210 P250 DR
R29 P250 SumCFRotated 1k
R30 SumCFRotated VSS 4.5k
J_A28 P247 Shift_Left 0 DR
J_B10 P249 Shift_Right 0 DR
J_A29 N207 SUMCF P251 DR
J_A30 P251 !Shift_ 0 DR
R31 VDD Shift_Enable 100k
J_F6 VDD Shift_Enable P252 DR
R32 P252 !Shift_ 1k
R33 !Shift_ VSS 4.8k
J_A31 N189 !Shift_ 0 DR
R34 VDD N189 50k
J_A32 VDD N189 P253 DR
R35 P253 N196 1k
R36 N196 VSS 4.5k
R37 VDD Shift_Direction 100k
J_F7 VDD Shift_Direction P254 DR
R38 P254 N205 1k
R39 N205 VSS 4.8k
J_A33 N201 N205 0 DR
R40 VDD N201 50k
J_A34 VDD N201 P255 DR
R41 P255 N200 1k
R42 N200 VSS 4.5k
R43 VDD N192 100k
J_F8 VDD N192 P256 DR
R44 P256 N199 1k
R45 N199 VSS 4.8k
J_B11 N192 N196 P257 DR
J_A35 N195 N199 0 DR
R46 VDD N195 50k
J_A36 VDD N195 P258 DR
R47 P258 Shift_Left 1k
R48 Shift_Left VSS 4.5k
J_B12 P257 N200 0 DR
R49 VDD N202 100k
J_F9 VDD N202 P259 DR
R50 P259 N211 1k
R51 N211 VSS 4.8k
J_B13 N202 N196 P260 DR
J_A37 N206 N211 0 DR
R52 VDD N206 50k
J_A38 VDD N206 P261 DR
R53 P261 Shift_Right 1k
R54 Shift_Right VSS 4.5k
J_B14 P260 N205 0 DR
R61 VDD CFStage1_Load 100k
J_F11 VDD CFStage1_Load P262 DR
R62 P262 !CFStage1_Loading 1k
R63 !CFStage1_Loading VSS 4.8k
J_A43 N013 !CFStage1_Loading 0 DR
R64 VDD N013 50k
J_A44 VDD N013 P263 DR
R65 P263 CFStage1_Loading 1k
R66 CFStage1_Loading VSS 4.5k
J_A46 N154 Acc3 P264 DR
J_B17 P264 Acc2 0 DR
J_A47 N154 T_Q3 P265 DR
J_B18 P265 Acc2 0 DR
J_A48 N178 N172 0 DR
R67 VDD N178 50k
J_A49 VDD N178 P266 DR
R68 P266 SUMCF 1k
R69 SUMCF VSS 4.5k
J_A50 N188 N172 0 DR
R70 VDD N188 50k
J_A51 VDD N188 P267 DR
R71 P267 SUMCF 1k
R72 SUMCF VSS 4.5k
.model NJF NJF
.model PJF PJF
.lib standard.jft
* AZ
* Temp Inverter
* Accumulator
* CF In
* Temporary Register
* CF Bus Out
.backanno
.end